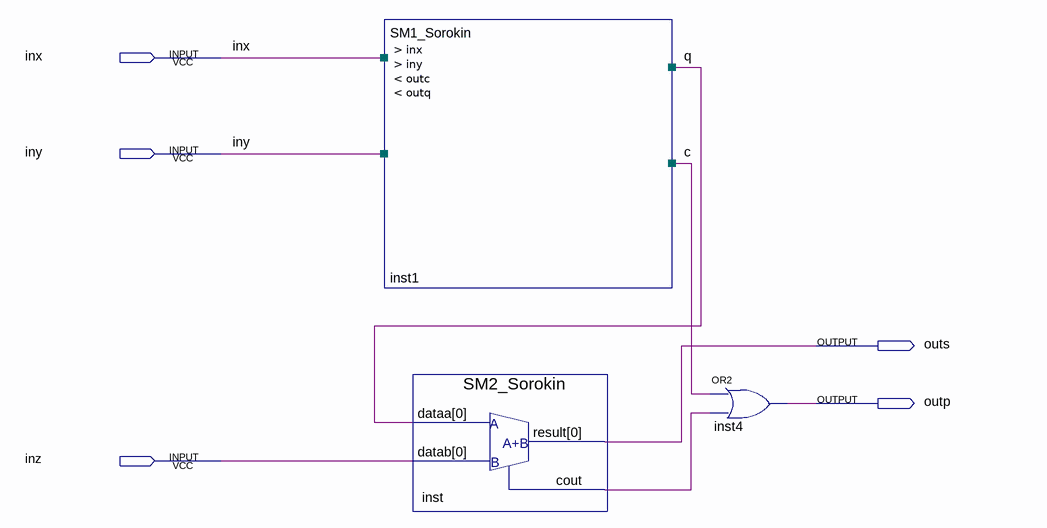
[diagram p0: schematic sheet]
// Quartus schematic CL_Project_Sorokin_Lab2.bdf as structural Verilog: 3 symbols, 5 pins
module CL_Project_Sorokin_Lab2 (
  input  inx,
  input  iny,
  input  inz,
  output outs,
  output outp
);

  wire c, inst_cout, q;

  SM1_Sorokin inst1 (.inx(inx), .iny(iny), .outc(c), .outq(q));
  SM2_Sorokin inst (.dataa(q), .datab(inz), .result(outs), .cout(inst_cout));
  or inst4 (outp, c, inst_cout);
endmodule
